# Altium schematic sheet Breadboard Power Module.SchDoc
size A3; SheetNumber: 1; SheetTotal: 1
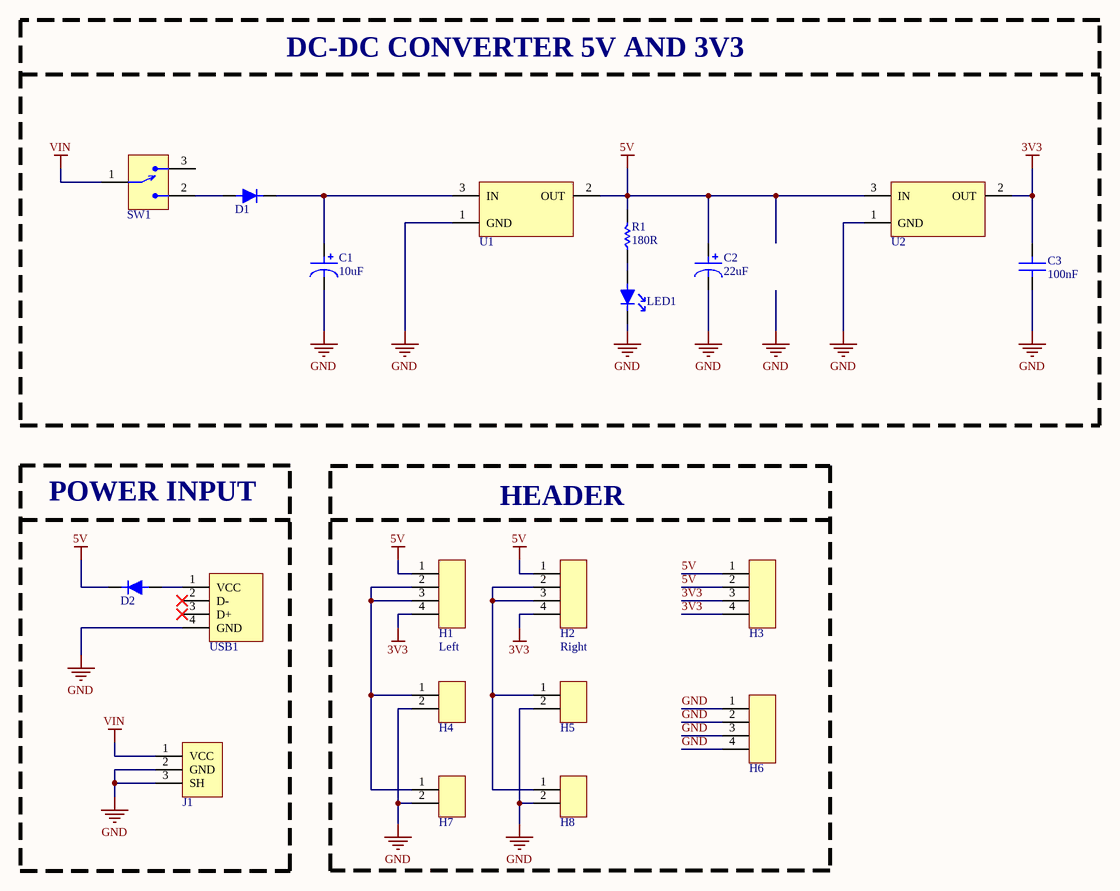
[diagram p0: Breadboard Power Module.SchDoc]

## Parts
C1  value 10uF  [CAP ALUM]  (hidden comment: EEH-ZA1H100R)
C2  value 22uF  [CAP ALUM]  (hidden comment: 35SVPF22M)
C3  value 100nF  [CAP 0805]  (hidden comment: CC0805KRX7R9BB104)
D1  MBR230LSFT1G  [DIODE]  (value not drawn)
D2  MBR230LSFT1G  [DIODE]  (value not drawn)
H1  61300411121  [HEADER 4 POS]  (value not drawn)
H2  61300411121  [HEADER 4 POS]  (value not drawn)
H3  61300411121  [HEADER 4 POS]  (value not drawn)
H4  61300211121  [HEADER 2 POS]  (value not drawn)
H5  61300211121  [HEADER 2 POS]  (value not drawn)
H6  61300411121  [HEADER 4 POS]  (value not drawn)
H7  61300211121  [HEADER 2 POS]  (value not drawn)
H8  61300211121  [HEADER 2 POS]  (value not drawn)
J1  54-00167  [POWER JACK]  (value not drawn)
LED1  151031VS06000  [LED DIODE]  (value not drawn)
R1  value 180R  [RES 0603]  (hidden comment: RC0603JR-07180RL)
SW1  450301014042  [SLIDE SWITCH]  (value not drawn)
U1  AMS1117-5.0  [LDO 5V]  (value not drawn)
U2  AMS1117-3.3  [LDO 3V3]  (value not drawn)
USB1  USB-A1HSW6  [USB]  (value not drawn)

## Blocks framed on the sheet
DC-DC CONVERTER 5V AND 3V3: C1-C3 D1 LED1 R1 SW1 U1 U2
POWER INPUT: D2 J1 USB1
HEADER: H1-H8

## Nets
3V3: C3.2 H1.4 H2.4 H3.3 H3.4 U2.2(OUT)
5V: C2.1 D2.2 H1.1 H2.1 H3.1 H3.2 R1.2 U1.2(OUT) U2.3(IN)
GND: C1.2 C2.2 C3.1 H4.2 H5.2 H6.1 H6.2 H6.3 H6.4 H7.2 H8.2 J1.2(GND) J1.3(SH) LED1.2 U1.1(GND) U2.1(GND) USB1.4(GND)
VIN: J1.1(VCC) SW1.1
NetC1_1: C1.1 D1.2 U1.3(IN)
NetD1_1: D1.1 SW1.2
NetD2_1: D2.1 USB1.1(VCC)
NetH1_2: H1.2 H1.3 H4.1 H7.1
NetH2_2: H2.2 H2.3 H5.1 H8.1
NetLED1_1: LED1.1 R1.1

Not connected (* = marked no-connect by the designer): SW1 3; USB1 2(D-)* 3(D+)*

## Notes on the sheet
- Left
- Right
- Dosya Adı / File Name
- Hazırlayan / Prepared By
- Tanım / Description
- Değiştirme Tarihi / Changed Date
- Bölüm / Department
- Onaylayan / Approved By
- Kontrol Eden / Checked By
- Boyut / Size
- Sayfa / Sheet
- Revizyon / Revision

## Library data of the parts
C1 = CAP ALUM 10uF SMD: CAP ALUM 10UF 20% 50V SMD
C2 = CAP ALUM 22uF SMD: CAP ALUM 22UF 20% 35V SMD
C3 = CAP CER 0.1uF 0805: CAP CER 0.1UF 50V X7R 0805; Manufacturer: Yageo; Material: Ceramic; Tolerance: 10%; Insulation Resistance: 100GR; Supplier: Digikey; Supplier Part Number: 311-1140-1-ND; Manufacturer Part Number: CC0805KRX7R9BB104; RoHS: Yes; Category: Ceramic Capacitors; Stock: 4302952; Pricing: 1=0,1, 10=0,058, 50=0,0396, 100=0,0341, 500=0,0248, 1000=0,02191, 4000=0,01754, 8000=0,01591, 12000=0,01509, 20000=0,01417, 28000=0,01364, 40000=0,01312, 100000=0,012, 200000=0,01132, 400000=0,01076 (USD); Mounting Technology: Surface Mount; Case/Package: 0805; Pins: 2; Case Code (Metric): 2012; Case Code (Imperial): 0805; Min Operating Temperature: -55°C; Max Operating Temperature: 125°C; Dielectric: X7R; Voltage: 50V; Packaging: Tape and Reel; Voltage Rating: 50V; Package Quantity: 4000; Termination: SMD/SMT; Series: CC; Length: 2mm; Height: 0.85mm; Depth: 1.25mm; Radiation Hardening: No; RoHS Compliant: Yes; Reach SVHC Compliant: No; Lead Free: 5697LeadFree; Halogen Free: 5694HalogenFree; ComponentLink1URL: https://datasheet.ciiva.com/11786/0900766b80d84f1d-11786009.pdf?src-supplier=Rs; ComponentLink1Description: https://datasheet.ciiva.com/11786/0900766b80d84f1d-11786009.pdf?src-supplier=Rs; ComponentLink2URL: https://datasheet.ciiva.com/46393/1734573-46393307.pdf?src-supplier=Element14; ComponentLink2Description: https://datasheet.ciiva.com/46393/1734573-46393307.pdf?src-supplier=Element14; ComponentLink3URL: https://datasheet.ciiva.com/155/mlccorderingcode-155930.pdf?src-supplier=Digikey; ComponentLink3Description: https://datasheet.ciiva.com/155/mlccorderingcode-155930.pdf?src-supplier=Digikey; ComponentLink4URL: https://datasheet.ciiva.com/28450/1489800-28450805.pdf?src-supplier=Element14; ComponentLink4Description: https://datasheet.ciiva.com/28450/1489800-28450805.pdf?src-supplier=Element14; ComponentLink5URL: https://datasheet.ciiva.com/155/mlccorderingcode-155929.pdf?src-supplier=Digikey; ComponentLink5Description: https://datasheet.ciiva.com/155/mlccorderingcode-155929.pdf?src-supplier=Digikey; ComponentLink6URL: https://datasheet.ciiva.com/155/mlccorderingcode-155931.pdf?src-supplier=Digikey; ComponentLink6Description: https://datasheet.ciiva.com/155/mlccorderingcode-155931.pdf?src-supplier=Digikey; ComponentLink7URL: https://datasheet.ciiva.com/11464/upy-gphc-x7r-6-3v-to-50v-8-11464757.pdf?src-supplier=Avnet; ComponentLink7Description: https://datasheet.ciiva.com/11464/upy-gphc-x7r-6-3v-to-50v-8-11464757.pdf?src-supplier=Avnet; ComponentLink8URL: https://datasheet.ciiva.com/29242/445210-da-01-en-kerko-chip-0805-x7r-0-1uf-10proz-50vg-29242074.pdf?src-supplier=Conrad; ComponentLink8Description: https://datasheet.ciiva.com/29242/445210-da-01-en-kerko-chip-0805-x7r-0-1uf-10proz-50vg-29242074.pdf?src-supplier=Conrad
D1 D2 = DIODE SMD: DIODE SCHOTTKY 30V 2A; Manufacturer: Sangdest Microelectronics; Manufacturer Part Number: 1N4007FL; Value: 6pF; Forward Current: 1A; Max Forward Surge Current (Ifsm): 30A; Max Repetitive Reverse Voltage (Vrrm): 1kV; Max Reverse Current: 5uA; Supplier: Digikey; Supplier Part Number: 1655-1N4007FLCT-ND; RoHS: No; Category: Diodes; Stock: 333059; Pricing: 1=0,1, 10=0,058, 100=0,039, 500=0,02954, 1000=0,02627 (USD); Min Operating Temperature: -55°C; Max Operating Temperature: 150°C; Reverse Voltage: 1kV; Height: 1.1mm
H1-H3 H6 = HEADER TH 4 POS: CONN HEADER VERT 4POS 2.54MM; Manufacturer: Wurth Electronics; Number of Positions: 4; Operating Supply Voltage: 250V; Current Rating: 3A; Gender: 29Gender; Contact Resistance: 20mR; Pitch: 0.1inch; Supplier: Digikey; Supplier Part Number: 732-5317-ND; Manufacturer Part Number: 61300411121; RoHS: Yes; Category: Headers and Wire Housings; Stock: 35642; Pricing: 1=0,19, 10=0,163, 25=0,1352, 50=0,113, 100=0,102, 1000=0,094 (USD); Mounting Technology: Through Hole; Contact Plating: Gold; Contact Material: Copper; Color: Black; Min Operating Temperature: -40°C; Max Operating Temperature: 105°C; Number of Rows: 1; Packaging: Bulk; Termination: Solder; Number of Contacts: 4; Series: WR-PHD; Contact Type: Male Pin; Orientation: 5495OrientationType; Voltage Rating: 250V; Height: 8.89mm; Contact Mating Length: 0.236inch; RoHS Compliant: Yes; Reach SVHC Compliant: Unknown; Lead Free: 5697LeadFree; ComponentLink1URL: http://www.farnell.com/cad/1737268.pdf?src-supplier=Element14; ComponentLink1Description: http://www.farnell.com/cad/1737268.pdf?src-supplier=Element14; ComponentLink2URL: https://datasheet.octopart.com/61300411121-W%C3%BCrth-Elektronik-datasheet-21154836.pdf?src-supplier=Element14; ComponentLink2Description: https://datasheet.octopart.com/61300411121-W%C3%BCrth-Elektronik-datasheet-21154836.pdf?src-supplier=Element14; ComponentLink3URL: https://katalog.we-online.de/em/datasheet/6130xx11121.pdf?src-supplier=Digikey; ComponentLink3Description: https://katalog.we-online.de/em/datasheet/6130xx11121.pdf?src-supplier=Digikey
H4 H5 H7 H8 = HEADER TH 2 POS: CONN HEADER VERT 2POS 2.54MM
J1 = POWER JACK: CONN JACK R/A PCB 5.5X2.5MM; ComponentLink1URL: https://datasheet.ciiva.com/26837/getdatasheetpartid-572408-26837414.pdf?src-supplier=Verical; ComponentLink1Description: https://datasheet.ciiva.com/26837/getdatasheetpartid-572408-26837414.pdf?src-supplier=Verical; ComponentLink2URL: https://datasheet.ciiva.com/16318/typ-4840-1200-16318967.pdf?src-supplier=Future+Electronics; ComponentLink2Description: https://datasheet.ciiva.com/16318/typ-4840-1200-16318967.pdf?src-supplier=Future+Electronics; ComponentLink3URL: https://datasheet.ciiva.com/12342/typ-4840-2201-65401-12342879.pdf?src-supplier=Mouser; ComponentLink3Description: https://datasheet.ciiva.com/12342/typ-4840-2201-65401-12342879.pdf?src-supplier=Mouser; ComponentLink4URL: https://datasheet.ciiva.com/391/typ-4840-2201-391834.pdf?src-supplier=Digikey; ComponentLink4Description: https://datasheet.ciiva.com/391/typ-4840-2201-391834.pdf?src-supplier=Digikey
LED1 = GREEN LED TH: LED GREEN 3MM ROUND T/H; Manufacturer: Wurth Electronics; Luminous Intensity: 30mcd; Forward Voltage: 2.2V; Wavelength: 568nm; Viewing Angle: 60°; Lens Style: Round,Domed,Circular; Test Current: 20mA; Forward Current: 30mA; Lens Transparency: Diffused; Max Reverse Voltage (DC): 5V; Supplier: Digikey; Supplier Part Number: 732-5008-ND; Manufacturer Part Number: 151031VS06000; RoHS: Yes; Category: LEDs; Stock: 21165; Pricing: 1=0,16, 50=0,155, 100=0,133, 500=0,115 (USD); Mounting Technology: Through Hole; Case/Package: Radial; Color: Green; Lens Color: Green; Min Operating Temperature: -40°C; Max Operating Temperature: 85°C; Dominant Wavelength: 568nm; Series: WL-TMRC; Length: 3mm; Width: 3mm; Height: 5.55mm; Lens Size: 3mm; Lead Free: Lead Free; RoHS Compliant: Yes; Reach SVHC Compliant: Unknown; ComponentLink1URL: https://datasheet.ciiva.com/22657/151031vs06000-22657015.pdf?src-supplier=Element14; ComponentLink1Description: https://datasheet.ciiva.com/22657/151031vs06000-22657015.pdf?src-supplier=Element14; ComponentLink2URL: https://datasheet.ciiva.com/29363/759487-da-01-en-tht-led-3mm-b-gruen-151031vs06000-29363829.pdf?src-supplier=Conrad; ComponentLink2Description: https://datasheet.ciiva.com/29363/759487-da-01-en-tht-led-3mm-b-gruen-151031vs06000-29363829.pdf?src-supplier=Conrad
R1 = RES 180 OHM 0603: RES 180 OHM 5% 1/10W 0603; Manufacturer: Stackpole Electronics; Manufacturer Part Number: RNCF0603DTE330R; Power Rating: 63mW; Tolerance: 0.5%; Supplier: Digikey; Supplier Part Number: 738-RNCF0603DTE330RDKR-ND; RoHS: Yes; Category: Chip SMD Resistors; Stock: 31710; Pricing: 1=0,1, 10=0,049, 50=0,039, 100=0,0352, 500=0,02744, 1000=0,02453 (USD); Mounting Technology: Surface Mount; Case/Package: 0603; Min Operating Temperature: -55°C; Max Operating Temperature: 155°C; Packaging: Tape and Reel; RoHS Compliant: Yes; ComponentLink1URL: https://www.seielect.com/catalog/sei-rncf.pdf?src-supplier=Digikey; ComponentLink1Description: https://www.seielect.com/catalog/sei-rncf.pdf?src-supplier=Digikey
SW1 = SLIDE SWITCH: SWITCH SLIDE SPDT 500MA 12V; Manufacturer: Wurth Electronics; Supplier: Digikey; Supplier Part Number: 450301014042-ND; Manufacturer Part Number: 450301014042; RoHS: Yes; Category: Slide Switches; Stock: 2836; Pricing: 1=2,25, 10=2,091, 50=1,9, 100=1,728, 200=1,503, 400=1,344 (USD); ComponentLink1URL: https://datasheet.ciiva.com/7638/450301014042-7638130.pdf?src-supplier=Element14; ComponentLink1Description: https://datasheet.ciiva.com/7638/450301014042-7638130.pdf?src-supplier=Element14; ComponentLink2URL: https://datasheet.ciiva.com/30466/0900766b8126a6c7-30466803.pdf?src-supplier=Rs; ComponentLink2Description: https://datasheet.ciiva.com/30466/0900766b8126a6c7-30466803.pdf?src-supplier=Rs; ComponentLink3URL: https://datasheet.ciiva.com/29124/711770-da-01-en-mini-schiebeschalter-450301014042-29124009.pdf?src-supplier=Conrad; ComponentLink3Description: https://datasheet.ciiva.com/29124/711770-da-01-en-mini-schiebeschalter-450301014042-29124009.pdf?src-supplier=Conrad
U1 = LDO 5V SMD: IC LDO REG 5V 1A SOT223; ComponentLink1URL: https://datasheet.ciiva.com/36525/1390266-36525981.pdf?src-supplier=Jameco; ComponentLink1Description: https://datasheet.ciiva.com/36525/1390266-36525981.pdf?src-supplier=Jameco; ComponentLink2URL: https://datasheet.ciiva.com/1511/1776449-1511575.pdf?src-supplier=Element14; ComponentLink2Description: https://datasheet.ciiva.com/1511/1776449-1511575.pdf?src-supplier=Element14; ComponentLink3URL: https://datasheet.ciiva.com/2041/cd00000544-2041930.pdf?src-supplier=Digikey; ComponentLink3Description: https://datasheet.ciiva.com/2041/cd00000544-2041930.pdf?src-supplier=Digikey; ComponentLink4URL: https://datasheet.ciiva.com/2041/cd00000544-2041929.pdf?src-supplier=Digikey; ComponentLink4Description: https://datasheet.ciiva.com/2041/cd00000544-2041929.pdf?src-supplier=Digikey; ComponentLink5URL: https://datasheet.ciiva.com/2041/cd00000544-2041931.pdf?src-supplier=Digikey; ComponentLink5Description: https://datasheet.ciiva.com/2041/cd00000544-2041931.pdf?src-supplier=Digikey; ComponentLink6URL: https://datasheet.ciiva.com/22694/1776449-22694853.pdf?src-supplier=Element14; ComponentLink6Description: https://datasheet.ciiva.com/22694/1776449-22694853.pdf?src-supplier=Element14; ComponentLink7URL: https://datasheet.ciiva.com/7992/1776449-7992623.pdf?src-supplier=Element14; ComponentLink7Description: https://datasheet.ciiva.com/7992/1776449-7992623.pdf?src-supplier=Element14
U2 = LDO 3V3 SMD: IC LDO REG 3.3V 1A SOT223; ComponentLink1URL: https://datasheet.ciiva.com/2060/tlv1117lv-2060227.pdf?src-supplier=Digikey; ComponentLink1Description: https://datasheet.ciiva.com/2060/tlv1117lv-2060227.pdf?src-supplier=Digikey; ComponentLink2URL: https://datasheet.ciiva.com/2060/tlv1117lv-2060228.pdf?src-supplier=Digikey; ComponentLink2Description: https://datasheet.ciiva.com/2060/tlv1117lv-2060228.pdf?src-supplier=Digikey; ComponentLink3URL: https://datasheet.ciiva.com/2060/tlv1117lv-2060226.pdf?src-supplier=Digikey; ComponentLink3Description: https://datasheet.ciiva.com/2060/tlv1117lv-2060226.pdf?src-supplier=Digikey; ComponentLink4URL: https://datasheet.ciiva.com/46443/1857581-46443437.pdf?src-supplier=Element14; ComponentLink4Description: https://datasheet.ciiva.com/46443/1857581-46443437.pdf?src-supplier=Element14; ComponentLink5URL: https://datasheet.ciiva.com/46443/1857581-46443438.pdf?src-supplier=Element14; ComponentLink5Description: https://datasheet.ciiva.com/46443/1857581-46443438.pdf?src-supplier=Element14; ComponentLink6URL: https://datasheet.ciiva.com/46443/1857581-46443450.pdf?src-supplier=Element14; ComponentLink6Description: https://datasheet.ciiva.com/46443/1857581-46443450.pdf?src-supplier=Element14
USB1 = USB TYPE-A: CONN RCPT TYPEA 4POS R/A; Manufacturer: On-Shore Technology; Number of Contacts: 4; Gender: Receptacle; Number of Ports: 1; Shielding: Unshielded; Supplier: Digikey; Supplier Part Number: ED2989-ND; Manufacturer Part Number: USB-A1HSW6; RoHS: Yes; Category: USB Connectors; Stock: 13920; Pricing: 1=0,67, 10=0,511, 25=0,4592, 60=0,41517, 120=0,38358, 240=0,35492, 480=0,32881, 960=0,30511, 2400=0,27713 (USD); Mounting Technology: Through Hole,Horizontal; Contact Plating: Gold; Insulation Color: White; Min Operating Temperature: 0°C; Max Operating Temperature: 85°C; Packaging: Tray; Connector Type: USB; Series: -; Termination: Solder; RoHS Compliant: Yes; Flammability Rating: UL94 V-0; ComponentLink1URL: https://datasheet.ciiva.com/851/usb-a1hsxx-851712.pdf?src-supplier=Digikey; ComponentLink1Description: https://datasheet.ciiva.com/851/usb-a1hsxx-851712.pdf?src-supplier=Digikey